# EAGLE design l298 (EAGLE 5.10)
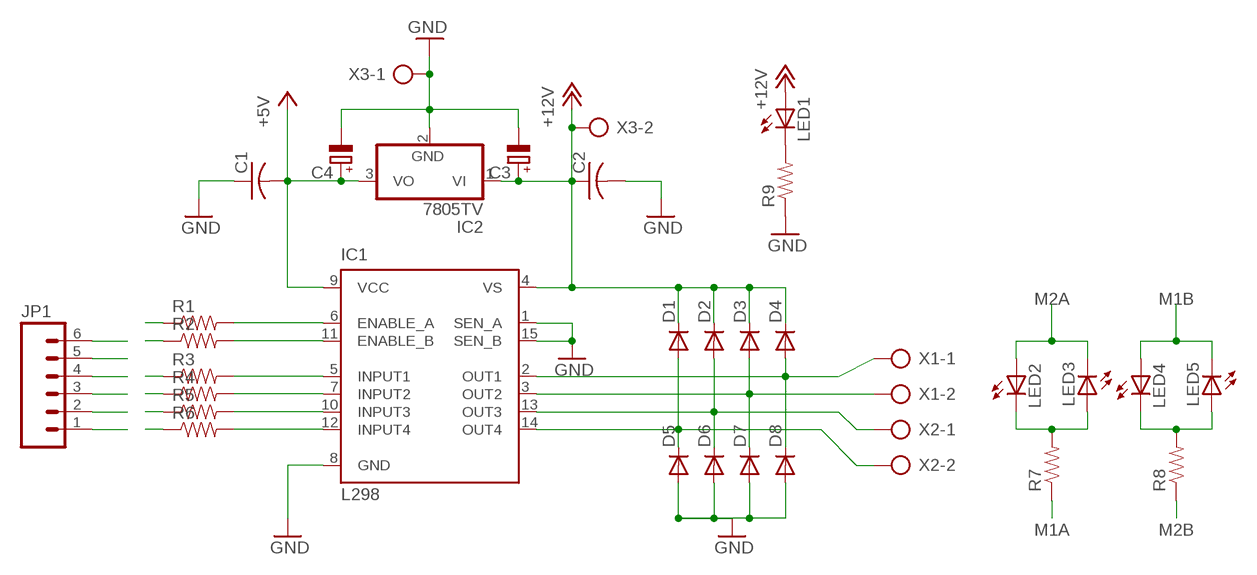
[diagram p0: schematic, sheet 1]

## Parts
C1  C-US025-024X044  [C025-024X044]
C2  C-US025-024X044  [C025-024X044]
C3  CPOL-EUE2-5  [E2-5]
C4  CPOL-EUE2-5  [E2-5]
D1  DIODE1N4148  [DIODE-1N4148]
D2  DIODE1N4148  [DIODE-1N4148]
D3  DIODE1N4148  [DIODE-1N4148]
D4  DIODE1N4148  [DIODE-1N4148]
D5  DIODE1N4148  [DIODE-1N4148]
D6  DIODE1N4148  [DIODE-1N4148]
D7  DIODE1N4148  [DIODE-1N4148]
D8  DIODE1N4148  [DIODE-1N4148]
IC1  L298  [MULTIWATT-15]
IC2  7805TV  [TO220V]
JP1  M06SIP  [1X06]
LED1  LED3MM  [LED3MM]
LED2  LED3MM  [LED3MM]
LED3  LED3MM  [LED3MM]
LED4  LED3MM  [LED3MM]
LED5  LED3MM  [LED3MM]
R1  RESISTORPTH-1/6W  [1/6W-RES]
R2  RESISTORPTH-1/6W  [1/6W-RES]
R3  RESISTORPTH-1/6W  [1/6W-RES]
R4  RESISTORPTH-1/6W  [1/6W-RES]
R5  RESISTORPTH-1/6W  [1/6W-RES]
R6  RESISTORPTH-1/6W  [1/6W-RES]
R7  RESISTORPTH-1/6W  [1/6W-RES]
R8  RESISTORPTH-1/6W  [1/6W-RES]
R9  RESISTORPTH-1/6W  [1/6W-RES]
X1  AK500/2  [AK500/2]
X2  AK500/2  [AK500/2]
X3  AK500/2  [AK500/2]

## Nets
2A: IC1.10(INPUT3) R5.2
+5V: C1.2 C4.+ IC1.9(VCC) IC2.3(VO)
+12V: C2.1 C3.+ D1.C D2.C D3.C D4.C IC1.4(VS) IC2.1(VI) LED1.A X3.2
A1: IC1.5(INPUT1) R3.2
B1: IC1.7(INPUT2) R4.2
B2: IC1.12(INPUT4) R6.2
GND: C1.1 C2.2 C3.- C4.- D5.A D6.A D7.A D8.A IC1.1(SEN_A) IC1.8(GND) IC1.15(SEN_B) IC2.2(GND) R9.1 X3.1
IN1_A: JP1.6 R3.1
IN1_B: JP1.4 R4.1
IN2_A: JP1.3 R5.1
IN2_B: JP1.1 R6.1
M1A: D4.A D8.C IC1.2(OUT1) R7.1 X1.1
M1B: D2.A D6.C IC1.13(OUT3) LED4.A LED5.K(C) X2.1
M2A: D3.A D7.C IC1.3(OUT2) LED2.A LED3.K(C) X1.2
M2B: D1.A D5.C IC1.14(OUT4) R8.1 X2.2
N$5: LED4.K(C) LED5.A R8.2
N$6: LED2.K(C) LED3.A R7.2
N$8: LED1.K(C) R9.2
PWM_A: JP1.5 R1.1
PWM_B: JP1.2 R2.1
PWMA: IC1.6(ENABLE_A) R1.2
PWMB: IC1.11(ENABLE_B) R2.2

## Library data of the parts
C1 C2 = rcl:C-US: CAPACITOR, American symbol
C3 C4 = rcl:CPOL-EU: POLARIZED CAPACITOR, European symbol
D1-D8 = SparkFun:DIODE: Diode These are standard reverse protection diodes and small signal diodes. SMA package can handle up to about 1A. SOD-323 can handle about 200mA. What the SOD-323 package when ordering, there are some mfgs out there that are 5-pin packages.
IC1 = st-microelectronics:L298: DUAL FULL-BRIDGE DRIVER
IC2 = linear:78*: Positive VOLTAGE REGULATOR Source: http://cache.national.com/ds/LM/LM78L05.pdf http://www.fairchildsemi.com/ds/LM/LM7805.pdf
JP1 = SparkFun:M06: Header 6 Standard 6-pin 0.1" header. Use with straight break away headers (SKU : PRT-00116), right angle break away headers (PRT-00553), swiss pins (PRT-00743), machine pins (PRT-00117), and female headers (PRT-00115). Molex polarized connector foot print use with SKU : PRT-08094 with associated crimp pins and housings. NOTES ON THE VARIANTS LOCK and LOCK_LONGPADS... This footprint was designed to help hold the alignment of a through-hole component (i.e. 6-pin header) while soldering it into place. You may notice that each hole has been shifted either up or down by 0.005 of an inch from it's more standard position (which is a perfectly straight line). This slight alteration caused the pins (the squares in the middle) to touch the edges of the holes. Because they are alternating, it causes a "brace" to hold the component in place. 0.005 has proven to be the perfect amount of "off-center" position when using our standard breakaway headers. Although looks a little odd when you look at the bare footprint, once you have a header in there, the alteration is very hard to notice. Also, if you push a header all the way into place, it is covered up entirely on the bottom side. This idea of altering the position of holes to aid alignment will be further integrated into the Sparkfun Library for other footprints. It can help hold any component with 3 or more connection pins.
LED1-LED5 = led:LED: LED OSRAM: - CHIPLED LG R971, LG N971, LY N971, LG Q971, LY Q971, LO R971, LY R971 LH N974, LH R974 LS Q976, LO Q976, LY Q976 LO Q996 - Hyper CHIPLED LW Q18S LB Q993, LB Q99A, LB R99A - SideLED LS A670, LO A670, LY A670, LG A670, LP A670 LB A673, LV A673, LT A673, LW A673 LH A674 LY A675 LS A676, LA A676, LO A676, LY A676, LW A676 LS A679, LY A679, LG A679 - Hyper Micro SIDELED® LS Y876, LA Y876, LO Y876, LY Y876 LT Y87S - SmartLED LW L88C, LW L88S LB L89C, LB L89S, LG L890 LS L89K, LO L89K, LY L89K LS L896, LA L896, LO L896, LY L896 - TOPLED LS T670, LO T670, LY T670, LG T670, LP T670 LSG T670, LSP T670, LSY T670, LOP T670, LYG T670 LG T671, LOG T671, LSG T671 LB T673, LV T673, LT T673, LW T673 LH T674 LS T676, LA T676, LO T676, LY T676, LB T676, LH T676, LSB T676, LW T676 LB T67C, LV T67C, LT T67C, LS T67K, LO T67K, LY T67K, LW E67C LS E67B, LA E67B, LO E67B, LY E67B, LB E67C, LV E67C, LT E67C LW T67C LS T679, LY T679, LG T679 LS T770, LO T770, LY T770, LG T770, LP T770 LB T773, LV T773, LT T773, LW T773 LH T774 LS E675, LA E675, LY E675, LS T675 LS T776, LA T776, LO T776, LY T776, LB T776 LHGB T686 LT T68C, LB T68C - Hyper Mini TOPLED® LB M676 - Mini TOPLED Santana® LG M470 LS M47K, LO M47K, LY M47K Source: http://www.osram.convergy.de LUXEON: - LUMILED® LXK2-PW12-R00, LXK2-PW12-S00, LXK2-PW14-U00, LXK2-PW14-V00 LXK2-PM12-R00, LXK2-PM12-S00, LXK2-PM14-U00 LXK2-PE12-Q00, LXK2-PE12-R00, LXK2-PE12-S00, LXK2-PE14-T00, LXK2-PE14-U00 LXK2-PB12-K00, LXK2-PB12-L00, LXK2-PB12-M00, LXK2-PB14-N00, LXK2-PB14-P00, LXK2-PB14-Q00 LXK2-PR12-L00, LXK2-PR12-M00, LXK2-PR14-Q00, LXK2-PR14-R00 LXK2-PD12-Q00, LXK2-PD12-R00, LXK2-PD12-S00 LXK2-PH12-R00, LXK2-PH12-S00 LXK2-PL12-P00, LXK2-PL12-Q00, LXK2-PL12-R00 Source: www.luxeon.com KINGBRIGHT: KA-3528ASYC Source: www.kingbright.com
R1-R9 = SparkFun:RESISTOR: Resistor Basic schematic elements and footprints for 0603, 1206, and PTH 1/10th watt (small) resistors.
X1-X3 = con-ptr500:AK500/2: CONNECTOR

## Board
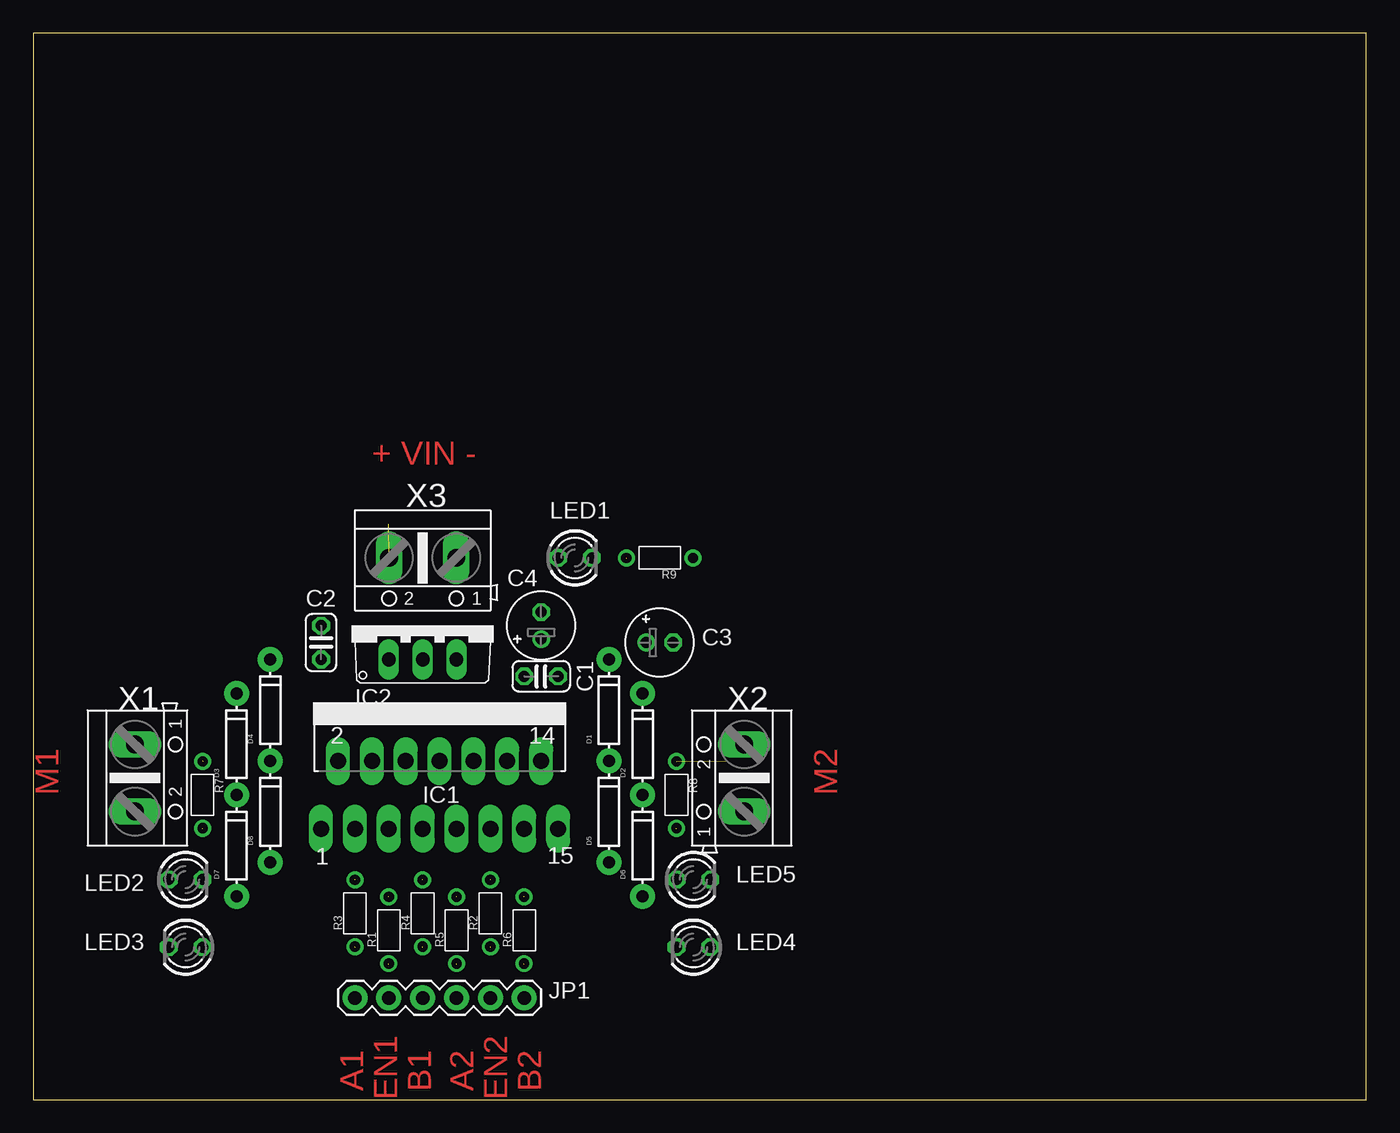
[diagram p1: board, top side]
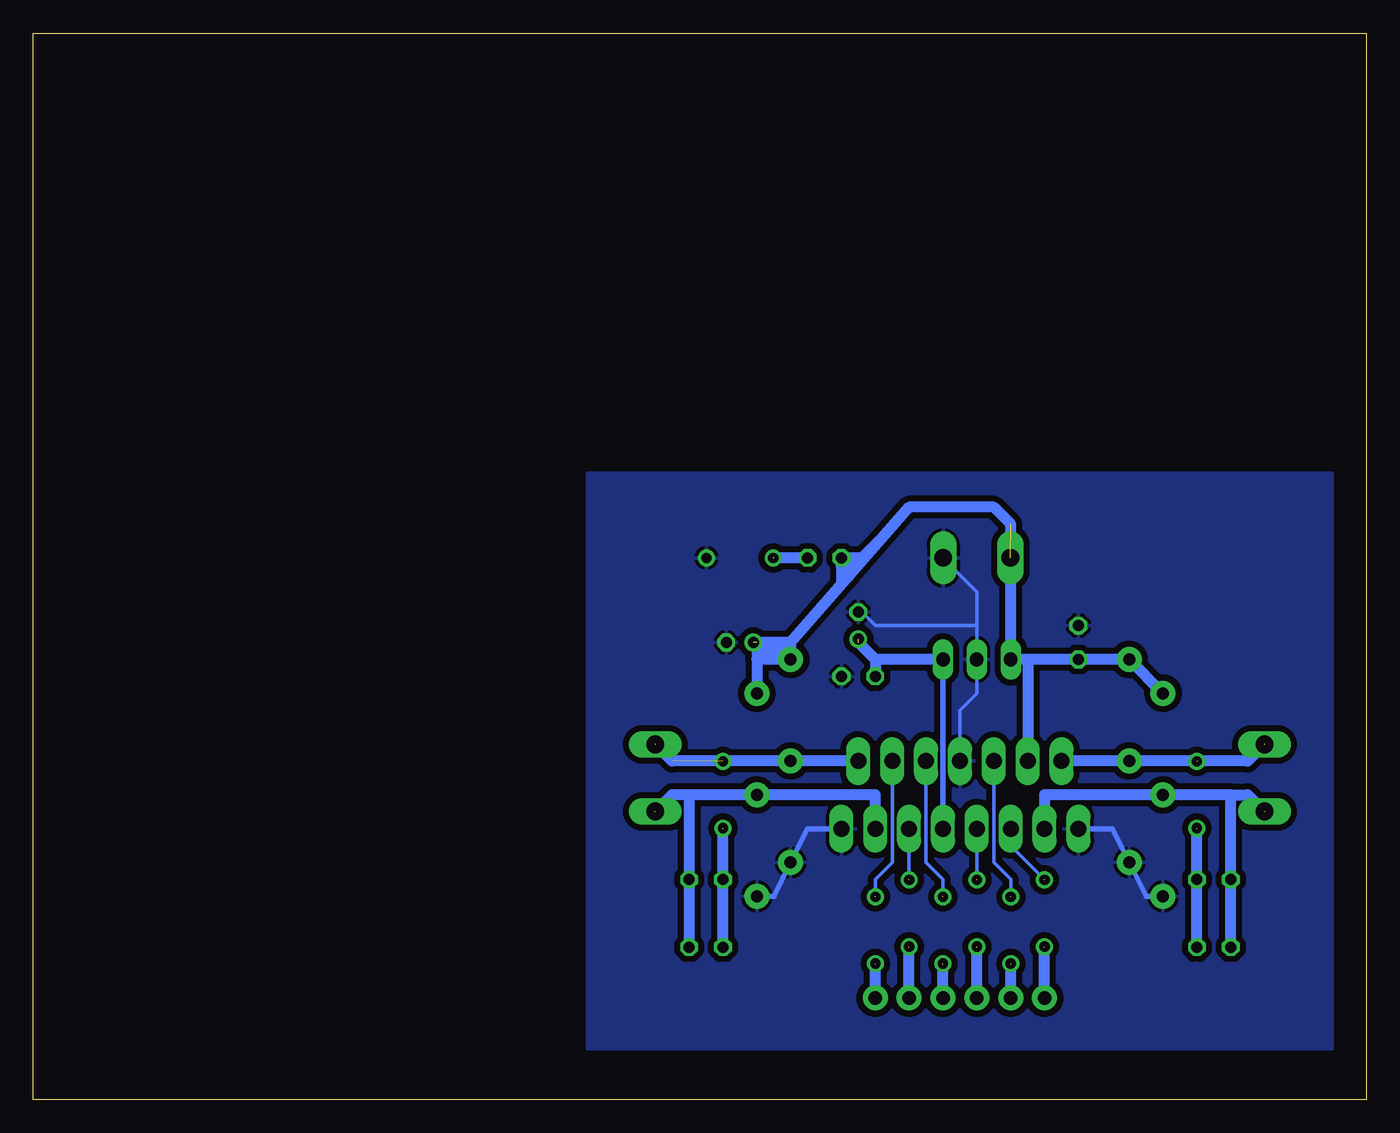
[diagram p2: board, bottom side, seen from below]

Size 100 x 80 mm. Coordinates in mm from the lower left corner, seen from the top.
Outline: 0,0 100,0 100,80 0,80 0,0
Copper layers (1*16): Top 0.035mm / dielectric 1.5mm / Bottom 0.035mm
Design rules "default *": minimum track width 10mil, minimum drill 24mil, track to track 18mil, track to pad 18mil, pad to pad 8mil, via to via 8mil, smd to smd 8mil, copper to edge 40mil, drill to drill 8mil, minimum pad ring 10mil, minimum via ring 8mil, stop-mask expansion 4mil, vias tented up to drill 0mil, thermal gap 10mil

### Footprints (pad centres in the part's own frame; a part is rotated, then mirrored left to right if it is on the bottom)
C025-024X044 = drill 0.813 octagon: 1 -1.27,0; 2 1.27,0
E2-5 = drill 0.813 pad 1.27 round: + -1.016,0 | drill 0.813 pad 1.27 octagon: - 1.016,0
DIODE-1N4148 = drill 0.9 pad 1.88 round: A -3.81,0; C 3.81,0
MULTIWATT-15 = drill 1.2 long: 1 -8.89,-7.62; 2 -7.62,-2.54; 3 -6.35,-7.62; 4 -5.08,-2.54; 5 -3.81,-7.62; 6 -2.54,-2.54; 7 -1.27,-7.62; 8 0,-2.54; 9 1.27,-7.62; 10 2.54,-2.54; 11 3.81,-7.62; 12 5.08,-2.54; 13 6.35,-7.62; 14 7.62,-2.54; 15 8.89,-7.62
TO220V = drill 1.016 long: 1 -2.54,-2.54; 2 0,-2.54; 3 2.54,-2.54
1X06 = drill 1.016 pad 1.88 round: 1 0,0; 2 2.54,0; 3 5.08,0; 4 7.62,0; 5 10.16,0; 6 12.7,0
LED3MM = drill 0.813 octagon: A -1.27,0; K 1.27,0
1/6W-RES = drill 0.762 round: 1 -2.5,0; 2 2.5,0
AK500/2 = drill 1.321 long: 1 -2.515,0; 2 2.515,0

### Placement (x,y rotation side)
C1  38.1,31.75 180 top
C2  21.59,34.29 90 top
C3  46.99,34.29 0 top
C4  38.1,35.56 90 top
D1  43.18,29.21 90 top
D2  45.72,26.67 90 top
D3  15.24,26.67 90 top
D4  17.78,29.21 90 top
D5  43.18,21.59 90 top
D6  45.72,19.05 90 top
D7  15.24,19.05 90 top
D8  17.78,21.59 90 top
IC1  30.48,27.94 0 top
IC2  29.21,35.56 0 top
JP1  36.83,7.62 180 top
LED1  40.64,40.64 0 top
LED2  11.43,16.51 0 top
LED3  11.43,11.43 180 top
LED4  49.53,11.43 180 top
LED5  49.53,16.51 0 top
R1  26.67,12.7 90 top
R2  34.29,13.97 90 top
R3  24.13,13.97 90 top
R4  29.21,13.97 90 top
R5  31.75,12.7 90 top
R6  36.83,12.7 90 top
R7  12.7,22.86 270 top
R8  48.26,22.86 270 top
R9  46.99,40.64 180 top
X1  7.62,24.13 270 top
X2  53.34,24.13 90 top
X3  29.21,40.64 180 top

### Tracks (layer width: path | path; a pad name or v marks a point on that pad's centre or on a via)
2A  (1 unrouted)
  Bottom 0.254: 31.75,15.24 31.75,16.51 33.02,17.78 IC1.10
+5V  (1 unrouted)
  Bottom 0.406: IC1.9 IC2.3
  Bottom 0.813: IC2.3 36.83,33.02 | 36.83,33.02 C1.2 | 36.83,33.02 38.1,34.29
+12V  (2 unrouted)
  Bottom 0.406: C2.1 25.4,33.02 IC2.1 | 34.29,44.45 38.1,40.64 LED1.A
  Bottom 0.813: 45.72,33.02 43.81,33.66 45.09,33.66 45.09,33.02 D1.C 43.18,34.29 | D2.C 45.72,34.29 43.18,34.29 | 25.4,33.02 IC1.4 | D3.C D4.C C2.1 IC2.1 26.67,43.18 27.94,44.45 34.29,44.45 43.18,34.29 | 38.73,39.37 39.37,38.73 LED1.A | 38.73,40.64 38.73,40.01 39.37,40.01 LED1.A | 38.1,40.64 38.73,40.64 | 38.73,40.64 LED1.A
A1  (1 unrouted)
  Bottom 0.254: 24.13,16.51 26.67,19.05 IC1.5
B1  (1 unrouted)
  Bottom 0.254: 29.21,16.51 IC1.7
B2  (1 unrouted)
  Bottom 0.254: 36.83,15.24 36.83,16.51 35.56,17.78 IC1.12
GND
  Bottom 0.254: IC1.8 30.48,29.21 29.21,30.48 IC2.2 29.21,35.56 | 29.21,35.56 36.83,35.56 38.1,36.83 | 31.75,40.64 29.21,38.1 29.21,35.56
  Bottom 0.406: D6.A 44.45,15.24 D5.A 41.91,20.32 IC1.15 | D7.A 16.51,15.24 D8.A 19.05,20.32 IC1.1
  pour Bottom: 2.54,46.99 2.54,3.81 58.42,3.81 58.42,46.99
IN1_A  (1 unrouted)
  Bottom 0.813: JP1.6 24.13,11.43
IN1_B  (1 unrouted)
  Bottom 0.813: JP1.4 29.21,11.43
IN2_A  (1 unrouted)
  Bottom 0.813: JP1.3 31.75,10.16
IN2_B  (1 unrouted)
  Bottom 0.813: JP1.1 36.83,10.16
M1A  (2 unrouted)
  Bottom 0.813: IC1.2 D8.C 12.7,25.4 8.89,25.4 7.62,26.67
M1B  (1 unrouted)
  Bottom 0.813: IC1.13 36.83,22.86 D6.C 50.8,22.86 | 50.8,22.86 52.07,22.86 53.34,21.59 | LED4.A LED5.K 50.8,22.86
M2A  (1 unrouted)
  Bottom 0.813: IC1.3 24.13,22.86 D3.A 10.16,22.86 | 10.16,22.86 8.89,22.86 7.62,21.59 | LED3.K LED2.A 10.16,22.86
M2B  (2 unrouted)
  Bottom 0.813: IC1.14 D1.A 52.07,25.4 53.34,26.67
N$5  (1 unrouted)
  Bottom 0.813: 48.26,20.32 LED4.K LED5.A
N$6  (1 unrouted)
  Bottom 0.813: 12.7,20.32 LED2.K LED3.A
N$8  (1 unrouted)
  Bottom 0.813: LED1.K 44.45,40.64
PWM_A  (1 unrouted)
  Bottom 0.813: JP1.5 26.67,10.16
PWM_B  (1 unrouted)
  Bottom 0.813: JP1.2 34.29,11.43
PWMA  (1 unrouted)
  Bottom 0.254: 26.67,15.24 26.67,16.51 27.94,17.78 IC1.6
PWMB  (1 unrouted)
  Bottom 0.254: 34.29,16.51 IC1.11

### Text on the board
Top: + VIN - | M1 | M2 | A1 | B1 | A2 | B2 | EN1 | EN2